# EAGLE schematic satellite_interface (EAGLE 6.1)
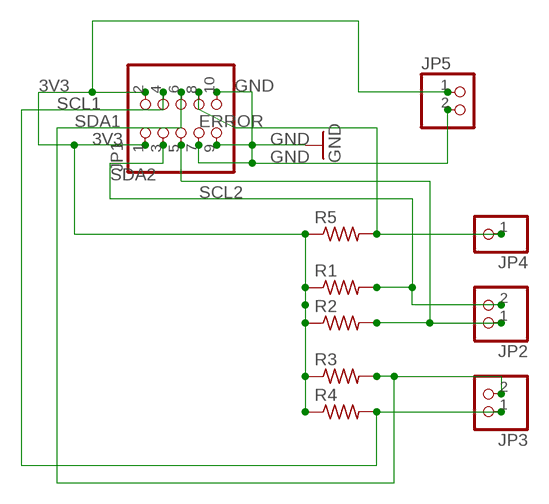
[diagram p0: schematic, sheet 1]

## Parts
JP1  PINHD-2X5  [2X05]
JP2  PINHD-1X2  [1X02]
JP3  PINHD-1X2  [1X02]
JP4  PINHD-1X1  [1X01]
JP5  PINHD-1X2  [1X02]
R1  R-US_M0805  [M0805]
R2  R-US_M0805  [M0805]
R3  R-US_M0805  [M0805]
R4  R-US_M0805  [M0805]
R5  R-US_M0805  [M0805]

## Nets
3V3: JP1.1 JP1.2 JP5.1 R1.1 R2.1 R3.1 R4.1 R5.1
ERROR: JP1.8 JP4.1 R5.2
GND: JP1.7 JP1.9 JP1.10 JP5.2
SCL1: JP1.4 JP3.1 R4.2
SCL2: JP1.5 JP2.1 R2.2
SDA1: JP1.6 JP3.2 R3.2
SDA2: JP1.3 JP2.2 R1.2

## Library data of the parts
JP1 = pinhead:PINHD-2X5: PIN HEADER
JP2 JP3 JP5 = pinhead:PINHD-1X2: PIN HEADER
JP4 = pinhead:PINHD-1X1: PIN HEADER
R1-R5 = resistor:R-US_: RESISTOR, American symbol

## Net classes
0 default: width 0.203 mm, drill 0.203 mm, clearance 0.203 mm